# EasyEDA Pro project ProPrj_两相交错电源demo_2025-05-26.epro, board PCB4
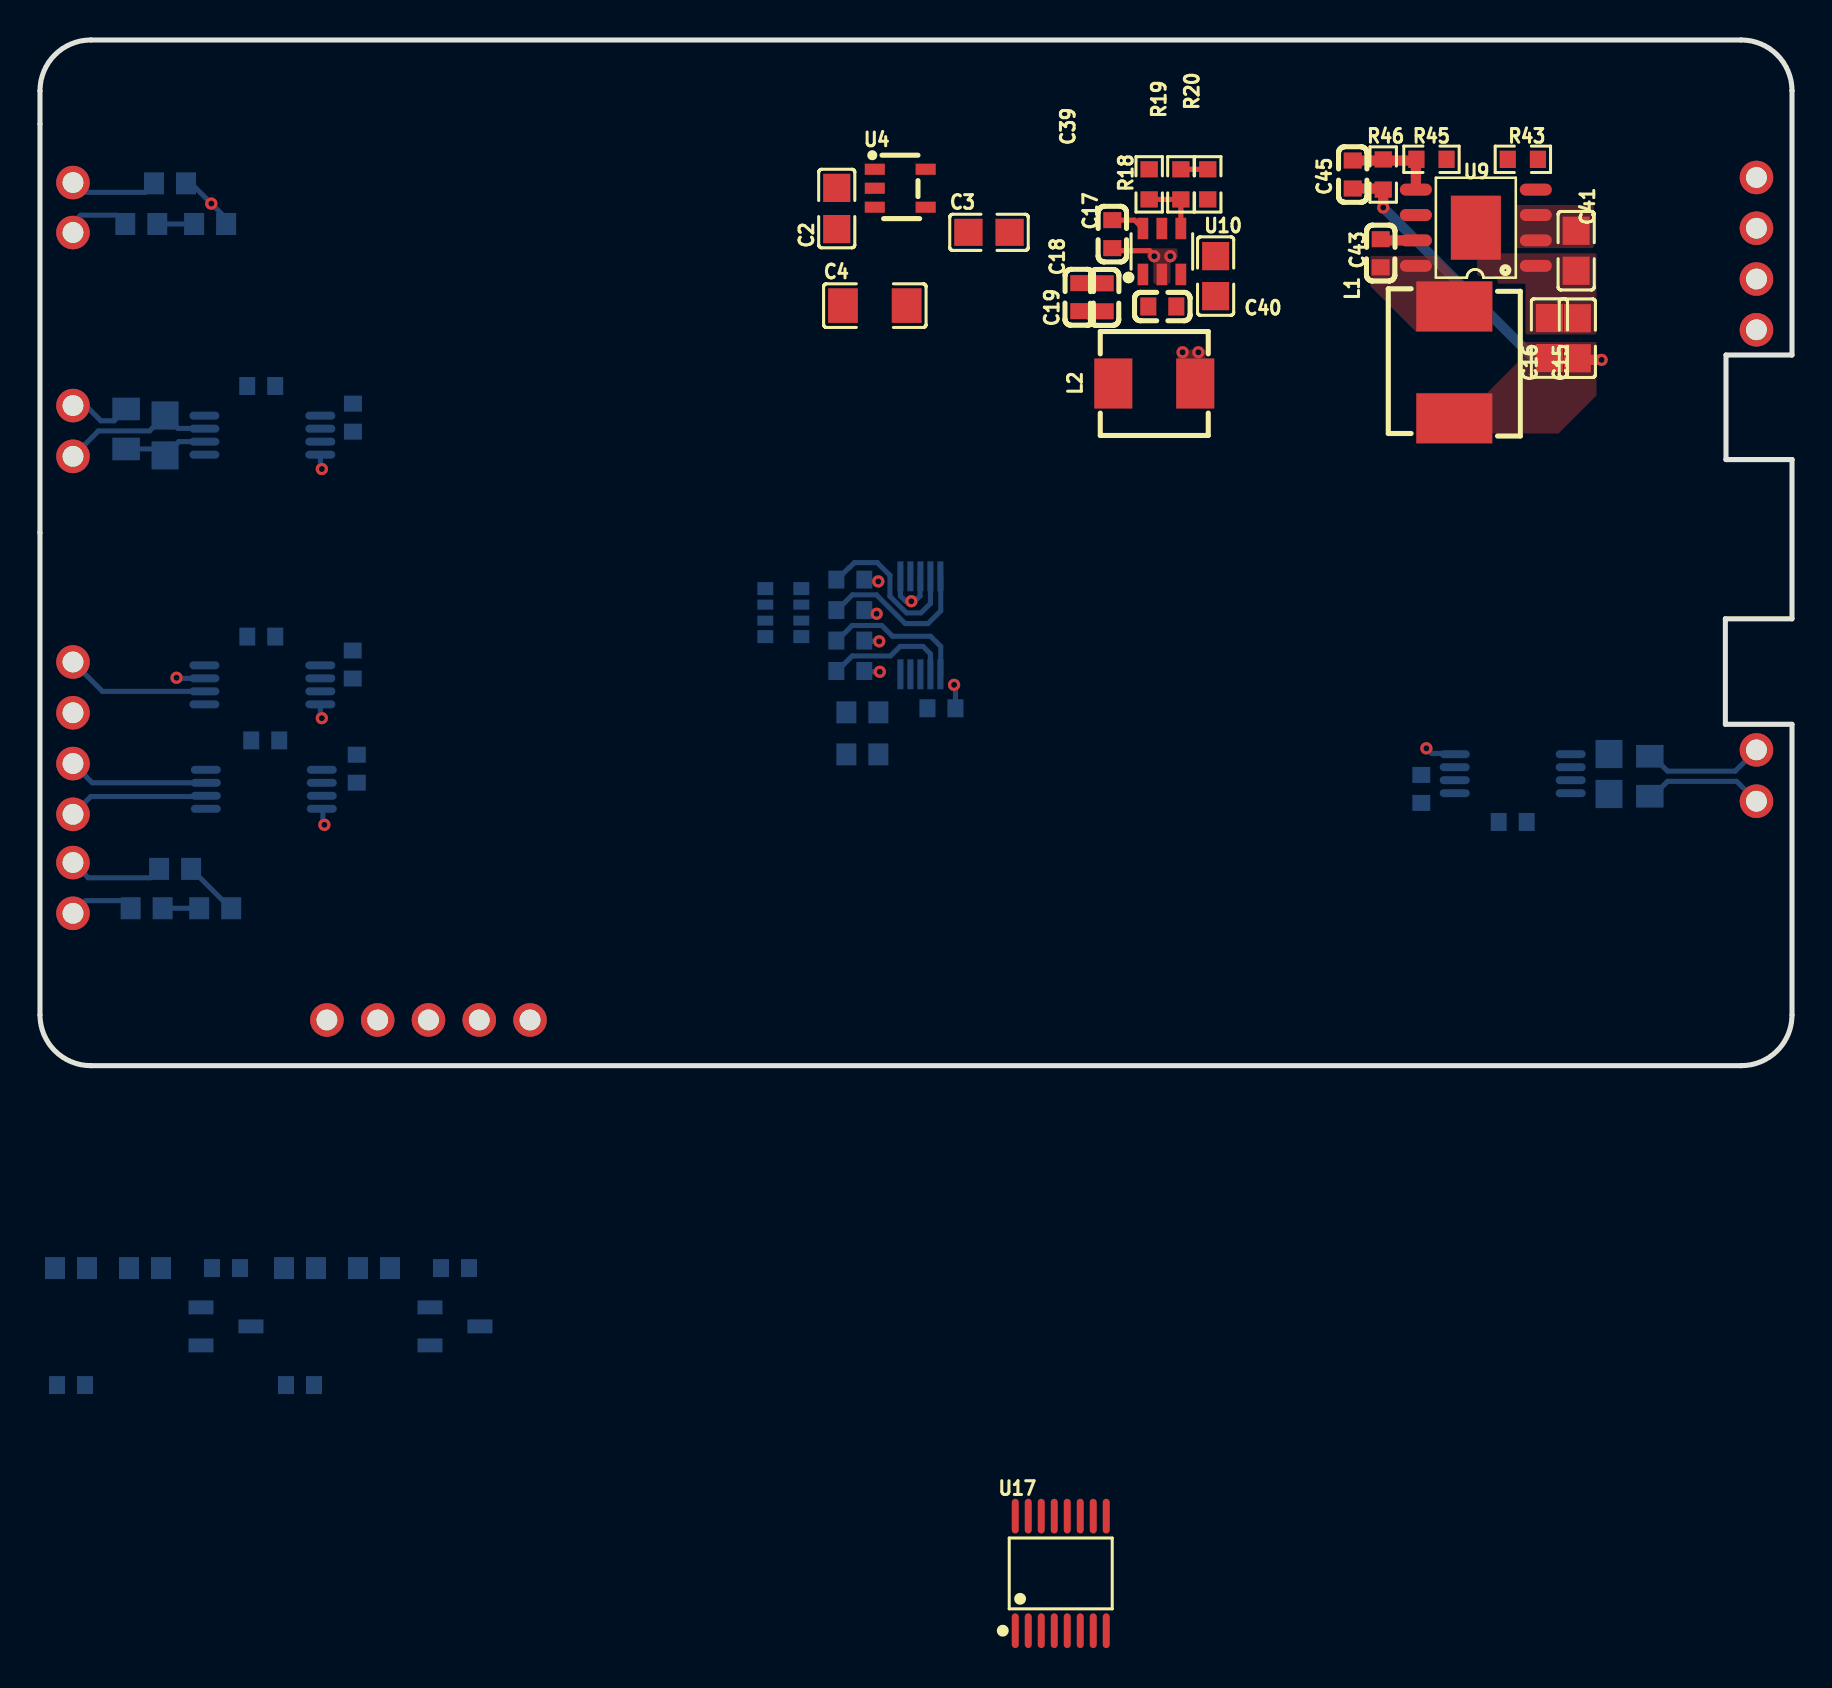
[diagram p11: board, top side]
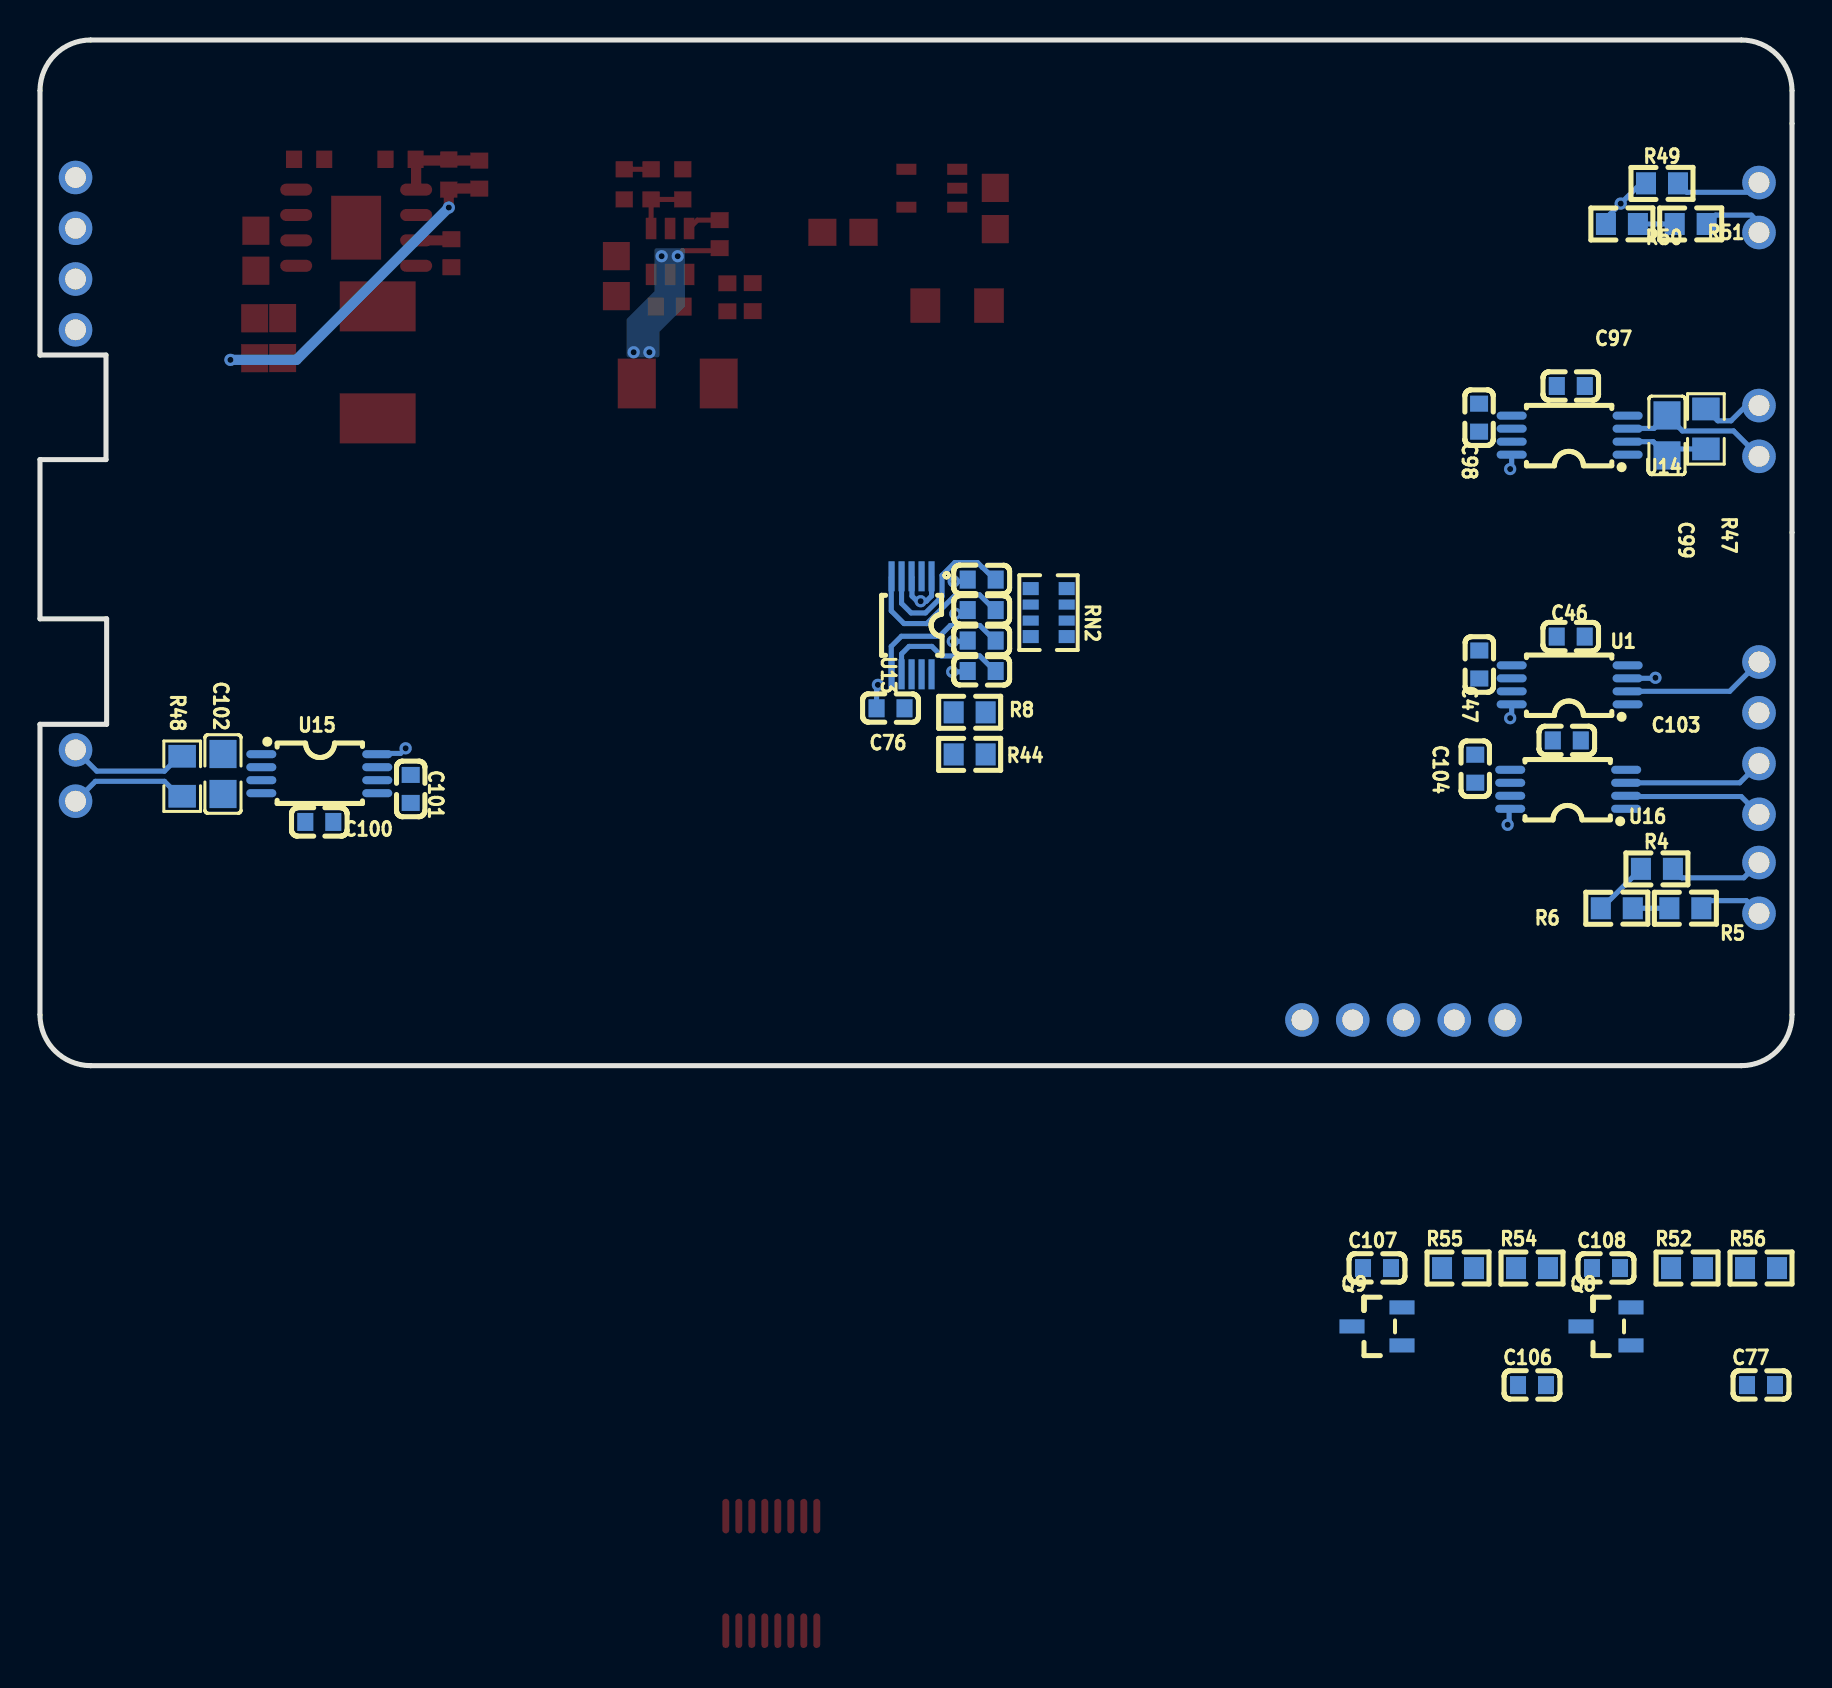
[diagram p12: board, bottom side, seen from below]

Outline 87.63 x 51.31 mm; copper layers: Top Layer, Inner1, Inner2, Bottom Layer. Coordinates in mm from the lower left corner of the outline.
Outline path: 0,48.77 0,2.54 arc(0.74,0.74) 2.54,0 85.09,0 arc(86.89,0.74) 87.63,2.54 87.63,17.08 84.3,17.08 84.3,22.35 87.63,22.35 87.63,30.32 84.33,30.32 84.33,35.55 87.63,35.55 87.63,48.77 arc(86.89,50.56) 85.09,51.31 2.54,51.31 arc(0.74,50.56) 0,48.77
Stack: Top Layer 0.035mm 外层铜厚1oz / Dielectric1 0.2104mm 7628 RC49% 8.6mil / Inner1 0.0152mm 内层铜厚 / Dielectric2 1.065mm 1.1mm H/HOZ Copper / Inner2 0.0152mm 内层铜厚 / Dielectric3 0.2104mm 7628 RC49% 8.6mil / Bottom Layer 0.035mm 外层铜厚1oz

## Design rules (mm)
template: 自定义配置
spacing copperThickness1oz (default): track to track 0.102, other pairs 0.152 to 0.3
spacing copperThickness2oz: track to track 0.203, other pairs 0.152 to 0.3
track width copperThickness1oz (default): min 0.127, default 0.254, max 2.54
track width copperThickness2oz: min 0.203, default 0.254, max 2.54
differential pair differentialPair (default): width min 0.127, default 0.254, max 2.54; gap min 0.152, default 0.152
via viaSize (default): diameter min 0.5, default 0.61, max 10; hole min 0.3, default 0.305, max 6.3

## Placement (name value [footprint] x y rotation side)
C2  10uF  [C0805]  39.85 42.88 90 top
C3  10uF  [C0805]  47.47 41.69 0 top
C4  1nF  [C1206]  41.76 38.02 0 top
C15  22uF  [C0805#2]  76.89 36.39 270 top
C16  22uF  [C0805#2]  75.5 36.4 270 top
C17  100nF  [C0603]  53.63 41.6 90 top
C18  22uF  [C0603]  53.25 38.44 90 top
C19  22uF  [C0603]  51.98 38.44 90 top
C39  4.7uF  [C0603]  56.13 37.97 180 top
C40  22uF  [C0805#2]  58.8 39.5 90 top
C41  2.2uF  [C0805#2]  76.84 40.77 270 top
C43  2.2nF  [C0603]  67.06 40.64 270 top
C45  56pF  [C0603]  65.66 44.58 270 top
C46  100nF  [C0603]  11.07 21.46 0 bottom
C47  1uF  [C0603]  15.64 20.07 270 bottom
C67  105/25V  [C0603#2]  40.53 19.74 180 bottom
C76  105/25V  [C0603#2]  45.09 17.88 180 bottom
C77  105/25V  [C0603#2]  1.55 -15.98 180 bottom
C79  105/25V  [C0603#2]  40.53 21.27 180 bottom
C95  105/25V  [C0603#2]  40.53 24.31 180 bottom
C96  105/25V  [C0603#2]  40.53 22.79 180 bottom
C97  100nF  [C0603]  11.07 34 0 bottom
C98  1uF  [C0603]  15.65 32.42 270 bottom
C99  4.7uF  [C0805#2]  6.25 31.53 90 bottom
C100  100nF  [C0603]  73.66 12.19 180 bottom
C101  1uF  [C0603]  69.09 13.84 90 bottom
C102  4.7uF  [C0805#2]  78.48 14.59 270 bottom
C103  100nF  [C0603]  11.27 16.27 0 bottom
C104  1uF  [C0603]  15.84 14.85 270 bottom
C106  105/25V  [C0603#2]  13 -15.98 180 bottom
C107  105/25V  [C0603#2]  20.76 -10.13 180 bottom
C108  105/25V  [C0603#2]  9.3 -10.13 180 bottom
L1  68uH  [IND-SMD_L7.1-W6.6-1]  70.74 35.18 270 top
L2  10uH  [IND-SMD_L5.4-W5.2_FXL0530]  55.73 34.12 180 top
NOREF  -  [Pad_e111]  19.43 2.29 90 top
NOREF#2  -  [Pad_e33]  85.85 15.8 0 top
NOREF#3  -  [Pad_e113]  1.65 44.18 0 top
NOREF#4  -  [Pad_e28]  1.65 15.11 0 top
NOREF#5  -  [Pad_e29]  1.65 12.57 0 top
NOREF#6  -  [Pad_e109]  14.35 2.29 90 top
NOREF#7  -  [Pad_e25]  1.65 30.48 0 top
NOREF#8  -  [Pad_e39]  85.85 36.81 0 top
NOREF#9  -  [Pad_e38]  85.85 39.35 0 top
NOREF#10  -  [Pad_e26]  1.65 20.19 0 top
NOREF#11  -  [Pad_e110]  16.89 2.29 90 top
NOREF#12  -  [Pad_e27]  1.65 17.65 0 top
NOREF#13  -  [Pad_e32]  85.85 13.23 0 top
NOREF#14  -  [Pad_e37]  85.85 41.89 0 top
NOREF#15  -  [Pad_e116]  1.65 7.62 0 top
NOREF#16  -  [Pad_e36]  85.85 44.43 0 top
NOREF#17  -  [Pad_e115]  1.65 10.16 0 top
NOREF#18  -  [Pad_e590]  24.51 2.29 90 top
NOREF#19  -  [Pad_e112]  21.97 2.29 90 top
NOREF#20  -  [Pad_e114]  1.65 41.68 0 top
NOREF#21  -  [Pad_e24]  1.65 33.02 0 top
Q8  S8050  [SOT-23-3_L2.9-W1.3-P1.90-LS2.4-TR]  9.3 -13.04 180 bottom
Q9  S8050  [SOT-23-3_L2.9-W1.3-P1.90-LS2.4-TR]  20.76 -13.04 180 bottom
R4  2K/0.1%  [R0603#2]  6.76 9.85 0 bottom
R5  20K/0.1%  [R0603#2]  8.76 7.87 180 bottom
R6  20K/0.1%  [R0603#2]  5.33 7.87 180 bottom
R8  5.1K  [R0603#2]  41.13 17.67 180 bottom
R18  100K  [R0603]  55.48 44.09 90 top
R19  12K  [R0603]  57.06 44.09 270 top
R20  1.5K  [R0603]  58.41 44.09 90 top
R43  100kΩ  [R0603]  74.17 45.34 0 top
R44  5.1K  [R0603#2]  41.13 15.57 180 bottom
R45  43kΩ  [R0603]  69.6 45.34 180 top
R46  390kΩ  [R0603]  67.18 44.58 270 top
R47  10kΩ  [R0805]  4.31 31.85 270 bottom
R48  10kΩ  [R0805]  80.52 14.48 90 bottom
R49  2K/0.1%  [R0603#2]  6.5 44.14 0 bottom
R50  20K/0.1%  [R0603#2]  8.51 42.1 180 bottom
R51  20K/0.1%  [R0603#2]  5.07 42.1 180 bottom
R52  30K  [R0603#2]  5.25 -10.13 180 bottom
R54  2K  [R0603#2]  13 -10.13 180 bottom
R55  30K  [R0603#2]  16.7 -10.13 180 bottom
R56  2K  [R0603#2]  1.55 -10.13 180 bottom
RN2  5.1K  [RES-ARRAY-SMD_0603-8P-L3.2-W1.6-BL]  37.18 22.66 90 bottom
U1  INA240A1PW  [TSSOP-8_L4.4-W3.0-P0.65-LS6.4-TL]  11.12 19.05 0 bottom
U4  -  [SOT-23-5_L3.0-W1.7-P0.95-LS2.8-TL]  43.03 43.89 0 top
U9  -  [SO-8_L4.9-W3.9-P1.27-LS6.0-BL-EP]  71.82 41.92 90 top
U10  TPS54302DDCR  [SOT-23-6_L2.9-W1.6-P0.95-LS2.8-BL]  56.11 40.73 0 top
U13  SGM58031  [MSOP-10_L3.0-W3.0-P0.50-LS5.0-BR]  44.04 22.03 90 bottom
U14  INA240A1PW  [TSSOP-8_L4.4-W3.0-P0.65-LS6.4-TL]  11.12 31.54 0 bottom
U15  INA240A1PW  [TSSOP-8_L4.4-W3.0-P0.65-LS6.4-TL]  73.66 14.61 180 bottom
U16  INA240A1PW  [TSSOP-8_L4.4-W3.0-P0.65-LS6.4-TL]  11.19 13.83 0 bottom
U17  LM5032MTCX/NOPB  [TSSOP-16_L5.0-W4.4-P0.65-LS6.4-BL]  51.05 -25.4 0 top

## Footprints (pads in the part's own frame, mm; a bottom-side part is the same pattern mirrored in y, then rotated)
C0603
  rect 0.8x0.9 smd: 1(-0.7,0) 2(0.7,0)
C0603#2
  custom 0.8x0.9 smd: 1(-0.7,0) 2(0.7,0)
C0805
  rect 1.409x1.351 smd: 1(-1.028,0) 2(1.031,0)
C0805#2
  rect 1.41x1.35 smd: 1(-1,0) 2(1,0)
C1206
  rect 1.486x1.727 smd: 1(-1.593,0) 2(1.593,0)
IND-SMD_L5.4-W5.2_FXL0530
  rect 1.9x2.5 smd: 1(-2.05,0) 2(2.05,0)
IND-SMD_L7.1-W6.6-1
  rect 2.5x3.8 smd: 1(-2.8,0) 2(2.8,0)
MSOP-10_L3.0-W3.0-P0.50-LS5.0-BR
  rect 1.5x0.305 smd: 1(2.451,-1) 2(2.451,-0.5) 3(2.451,0) 4(2.451,0.5) 5(2.451,1) 6(-2.451,1) 7(-2.451,0.5) 8(-2.451,0) 9(-2.451,-0.5) 10(-2.451,-1)
Pad_e24
  round 1.677 hole 1.042: 1(0,0)
Pad_e25
  round 1.677 hole 1.042: 1(0,0)
Pad_e26
  round 1.677 hole 1.042: 1(0,0)
Pad_e27
  round 1.677 hole 1.042: 1(0,0)
Pad_e28
  round 1.677 hole 1.042: 1(0,0)
Pad_e29
  round 1.677 hole 1.042: 1(0,0)
Pad_e32
  round 1.677 hole 1.042: 2(0,0)
Pad_e33
  round 1.677 hole 1.042: 1(0,0)
Pad_e36
  round 1.677 hole 1.042: 1(0,0)
Pad_e37
  round 1.677 hole 1.042: 1(0,0)
Pad_e38
  round 1.677 hole 1.042: 1(0,0)
Pad_e39
  round 1.677 hole 1.042: 1(0,0)
Pad_e109
  round 1.677 hole 1.042: 1(0,0)
Pad_e110
  round 1.677 hole 1.042: 1(0,0)
Pad_e111
  round 1.677 hole 1.042: 1(0,0)
Pad_e112
  round 1.677 hole 1.042: 1(0,0)
Pad_e113
  round 1.677 hole 1.042: 1(0,0)
Pad_e114
  round 1.677 hole 1.042: 1(0,0)
Pad_e115
  round 1.677 hole 1.042: 1(0,0)
Pad_e116
  round 1.677 hole 1.042: 1(0,0)
Pad_e590
  round 1.677 hole 1.042: 1(0,0)
R0603
  rect 0.806x0.864 smd: 1(-0.753,0) 2(0.753,0)
R0603#2
  rect 1x1.1 smd: 1(-0.8,0) 2(0.8,0)
R0805
  rect 1.133x1.377 smd: 1(-1,0) 2(1,0)
RES-ARRAY-SMD_0603-8P-L3.2-W1.6-BL
  rect 0.65x0.8 smd: 1(-1.2,-0.9) 4(1.2,-0.9) 5(1.2,0.9) 8(-1.2,0.9)
  rect 0.5x0.8 smd: 2(-0.4,-0.9) 3(0.4,-0.9) 6(0.4,0.9) 7(-0.4,0.9)
SO-8_L4.9-W3.9-P1.27-LS6.0-BL-EP
  oval 0.6x1.6 smd: 1(-1.905,-2.999) 2(-0.635,-2.999) 3(0.635,-2.999) 4(1.905,-2.999) 5(1.905,2.999) 6(0.635,2.999) 7(-0.635,2.999) 8(-1.905,2.999)
  rect 3.2x2.499 smd: 9(0,0)
SOT-23-3_L2.9-W1.3-P1.90-LS2.4-TR
  rect 1.25x0.7 smd: 1(1.25,0.95) 2(1.25,-0.95) 3(-1.25,0)
SOT-23-5_L3.0-W1.7-P0.95-LS2.8-TL
  rect 1.001x0.551 smd: 1(-1.272,0.95) 2(-1.272,0) 3(-1.272,-0.95) 4(1.272,-0.95) 5(1.272,0.95)
SOT-23-6_L2.9-W1.6-P0.95-LS2.8-BL
  rect 0.532x1.072 smd: 1(-0.95,-1.149) 2(0,-1.149) 3(0.95,-1.149) 4(0.95,1.149) 5(0,1.149) 6(-0.95,1.149)
TSSOP-8_L4.4-W3.0-P0.65-LS6.4-TL
  oval 1.5x0.4 smd: 1(-2.9,0.976) 2(-2.9,0.325) 3(-2.9,-0.325) 4(-2.9,-0.976) 5(2.9,-0.976) 6(2.9,-0.325) 7(2.9,0.325) 8(2.9,0.976)
TSSOP-16_L5.0-W4.4-P0.65-LS6.4-BL
  oval 0.343x1.732 smd: 1(-2.275,-2.866) 2(-1.625,-2.866) 3(-0.975,-2.866) 4(-0.325,-2.866) 5(0.325,-2.866) 6(0.975,-2.866) 7(1.625,-2.866) 8(2.275,-2.866) 9(2.275,2.866) 10(1.625,2.866) 11(0.975,2.866) 12(0.325,2.866) 13(-0.325,2.866) 14(-0.975,2.866) 15(-1.625,2.866) 16(-2.275,2.866)

## Nets
As in the schematic, except:
12V: C15.2 C16.2 C39.1 C40.1 C45.2 L1.2 NOREF#9.1 R46.2 U10.3
GND: C2.2 C3.1 C4.2 C15.1 C16.1 C18.2 C19.2 C39.2 C40.2 C41.2 C46.1 C47.1 C67.1 C76.1 C77.2 C79.1 C95.1 C96.1 C97.1 C98.1 C100.1 C101.1 C103.1 C104.1 C106.2 NOREF#3.1 NOREF#8.1 NOREF#16.1 NOREF#17.1 NOREF#18.1 R4.1 R20.1 R43.1 R45.1 R49.1 U1.4 U4.2 U9.1 U9.9 U10.1 U13.1 U13.3 U14.4 U15.4 U16.4
VCC: C2.1 C4.1 C41.1 NOREF#14.1 NOREF#20.1 R51.2 U4.1 U4.3 U9.2 U9.3
IFB_M2: C106.1 NOREF#11.1 R54.1 RN2.2
VFB_OUT: NOREF#6.1 R4.2 R5.1 RN2.1
VOUT: NOREF.1 NOREF#15.1 R6.2
$1N5061: C99.2 NOREF#7.1 U14.3
$1N5314: C102.1 NOREF#2.1 R48.2 U15.2

Pads without a net: NOREF#4 1; NOREF#5 1; NOREF#10 1; NOREF#12 1; NOREF#13 2; NOREF#21 1; R47 1; R48 1; U1 1 2 3; U4 4; U9 6; U10 5; U13 2; U14 1; U15 1; U16 1 2 3; U17 1 2 3 4 5 6 7 8 9 10 11 12 13 14 15 16

## Via types
v1: diameter 0.61, hole 0.305, Top Layer to Bottom Layer, 18 vias

## Routing (per net, layer and track width the routed paths; a pad name or vN(x,y) marks a point on that pad's centre or on a via; arc(x,y) is an arc through that point)
12V: length 17
  Top Layer w0.508: v1(67.18,42.93) R46.2 67.13,43.88 C45.2 ; v1(78.1,35.31) 77.6,35.31
  Bottom Layer w0.508: v1(67.18,42.93) 74.8,35.31 v1(78.1,35.31)
GND: length 16.5
  Bottom Layer w0.254: NOREF#17.1 2.41,9.4 5.51,9.4 R4.1 ; 41.23,22.75 41.38,22.61 v1(41.85,22.61) ; v1(41.93,24.22) 41.28,24.22 41.23,24.27 ; v1(41.97,21.23) 41.23,21.23 ; v1(42,19.7) 41.23,19.7 ; R49.1 5.26,43.69 2.14,43.69 NOREF#3.1 ; C76.1 45.79,18.98 v1(45.72,19.05) ; 44.04,24.44 44.02,24.42 44.02,23.49 43.76,23.23 v1(43.58,23.23) 43.3,23.23 43.04,23.5 43.04,24.44
VCC: length 3.4
  Bottom Layer w0.254: NOREF#20.1 1.65,42.16 2.03,42.55 3.83,42.55 R51.2
(no net): length 55.4
  Inner1 w0.254: 16.51,26.42 8.25,26.42 NOREF#21.1 ; v1(6.83,19.4) 6.22,18.8 2.79,18.8 NOREF#12.1
  Bottom Layer w0.254: NOREF#21.1 2.29,33.02 3.05,32.26 3.71,32.26 R47.1 ; v1(6.83,19.4) 6.86,19.38 U1.3 ; R48.1 80.66,13.48 81.41,14.22 84.86,14.22 NOREF#13.2 ; U1.2 3.12,18.73 NOREF#10.1 ; 8.3,14.15 2.61,14.15 NOREF#4.1 ; NOREF#5.1 2.54,13.46 8.26,13.46 U16.2
IFB_M1O: length 0.8
  Bottom Layer w0.254: v1(14.1,17.38) 14.02,17.46 14.02,18.1
IFB_M2O: length 0.8
  Bottom Layer w0.254: v1(14.22,12.05) 14.15,12.12 14.15,12.77
IL1: length 0.8
  Bottom Layer w0.254: v1(14.1,29.85) 14.02,29.92 U14.8
IL2: length 1.5
  Bottom Layer w0.254: v1(69.34,15.88) 69.6,15.62 70.72,15.62 U15.8
VFB_IN: length 52.8
  Inner1 w0.254: 23.88,4.32 19.43,8.76 19.43,40.13 16.44,43.12 v1(8.57,43.12)
  Bottom Layer w0.254: R49.2 7.56,44.14 v1(8.57,43.12) 9.31,42.38 R50.1
VFB_OUT: length 2.8
  Bottom Layer w0.254: R5.1 9.53,7.87 R4.2
VOUT: length 3.3
  Bottom Layer w0.254: R6.2 4.15,8.26 2.29,8.26 NOREF#15.1
$1N1189: length 1.8
  Top Layer w0.508: C43.1 67.11,41.28 68.82,41.28
$1N1190: length 4.7
  Top Layer w0.508: 68.78,45.28 R45.2 ; 68.78,45.28 C45.1 ; 68.78,45.28 68.82,45.24 68.82,43.82
$1N1584: length 2.3
  Top Layer w0.254: v1(55.73,40.49) 55.73,40.53 55.5,40.77 53.76,40.77 C17.1
  vias: v1(56.54,40.49) v1(57.15,35.69) v1(57.94,35.69)
$1N1585: length 1.7
  Top Layer w0.254: U10.6 54.74,42.3 C17.2
$1N1588: length 1.3
  Top Layer w0.254: R19.1 R20.2
$1N1594: length 3
  Top Layer w0.254: U10.4 R19.2 R18.1
$1N3839: length 8.1
  Bottom Layer w0.254: 45.04,24.44 45.05,24.42 45.05,22.75 44.42,22.12 43.27,22.12 41.84,23.55 40.63,23.55 39.83,22.75
$1N3840: length 8.2
  Bottom Layer w0.254: 44.54,24.44 44.54,23.12 44.06,22.65 43.34,22.65 42.51,23.48 42.51,24.53 41.88,25.16 40.73,25.16 40.48,24.91 40.47,24.91 39.83,24.27
$1N3841: length 7.4
  Bottom Layer w0.254: 39.83,21.23 40.62,22.02 42.1,22.02 42.64,21.48 44.54,21.48 45.05,20.97 45.05,19.55 45.04,19.54
$1N3849: length 6.4
  Bottom Layer w0.254: 39.83,19.7 40.62,20.5 42.55,20.5 43.02,20.97 44.16,20.97 44.54,20.6 44.54,19.54
$1N4972: length 4.3
  Bottom Layer w0.254: R47.2 5.93,30.85 C99.1 6.94,31.21 U14.2
$1N5061: length 7.7
  Bottom Layer w0.254: U14.3 8.21,31.88 6.9,31.88 C99.2 5.48,31.75 2.92,31.75 NOREF#7.1
$1N5314: length 6.1
  Bottom Layer w0.254: NOREF#2.1 84.79,14.73 81.41,14.73 80.66,15.48 R48.2
$1N5604: length 1.8
  Bottom Layer w0.254: R6.1 R5.2
$1N5700: length 1.8
  Bottom Layer w0.254: R50.2 R51.1

## Copper pours and planes (outline as drawn; the poured copper is in the pictures)
12V on Top Layer: 68.83,36.2 77.85,36.2 77.85,31.62 68.83,31.62
GND on Top Layer: 71.88,40.64 77.85,40.64 77.85,36.58 71.88,36.58
GND on Inner2: 0,54.23 35.18,54.23 35.18,-4.19 0,-4.19
VCC on Top Layer: 73.79,43.05 77.72,43.05 77.72,40.89 73.79,40.89
$1N1188 on Top Layer: 66.55,40.51 72.64,40.51 72.64,36.7 66.55,36.7
$1N1584 on Top Layer: 55.37,40.89 56.9,40.89 56.9,39.12 55.37,39.12
$1N1584 on Top Layer: 56.9,35.81 58.29,35.81 58.29,32.89 56.9,32.89
$1N1584 on Bottom Layer: 55.37,40.89 56.9,40.89 56.9,38.74 58.29,37.34 58.29,35.43 56.64,35.43 56.64,36.7 55.37,37.97
